# Altium schematic sheet Brelok(CR2430).SchDoc
size A4
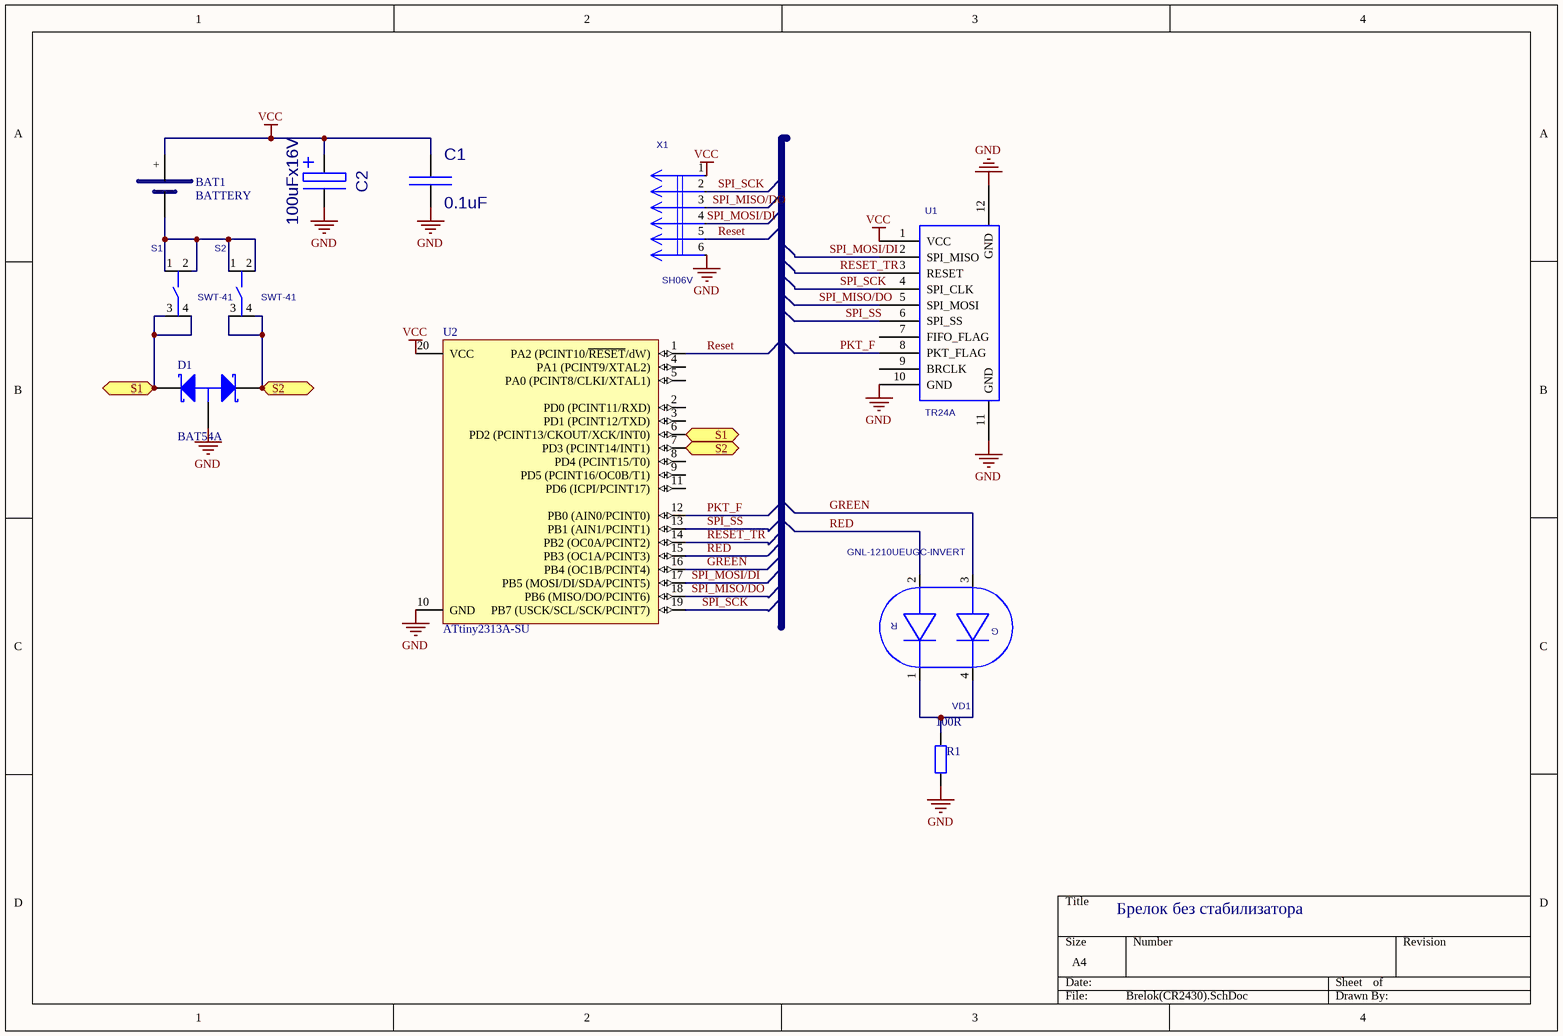
[diagram p0: Brelok(CR2430).SchDoc]

## Parts
BAT1  BATTERY  [HU2430]
C1  value 0.1uF  [C0805]  (hidden comment: KONDENS_SMD)
C2  100uFx16V  [CAP 5mm Horizontal]
D1  BAT54A  [SOT23_M]
R1  value 100R  [C0805]  (hidden comment: RES)
S1  SWT-41  [SWT-41]
S2  SWT-41  [SWT-41]
U1  TR24A  [TR24A]
U2  ATtiny2313A-SU  [20S_M]
VD1  GNL-1210UEUGC-INVERT  [GNL-1210UEUGC-INVERT]
X1  SH06V  [SH06V]

## Ports
S1, S2

## Nets
GND: C1.2(B) C2.2(MINUS) D1.3(A) R1.1 U1.10(GND) U1.11(GND) U1.12(GND) U2.10(GND) X1.6
VCC: BAT1.+ C1.1(A) C2.1(PLUS) U1.1(VCC) U2.20(VCC) X1.1
GREEN: U2.16(PB4_(OC1B/PCINT4)) VD1.3
PKT_F: U1.8(PKT_FLAG) U2.12(PB0_(AIN0/PCINT0))
RED: U2.15(PB3_(OC1A/PCINT3)) VD1.2
Reset: U2.1(PA2_(PCINT10/~{RESET}/dW)) X1.5
RESET_TR: U1.3(RESET) U2.14(PB2_(OC0A/PCINT2))
S1: D1.2(K2) S1.3 S1.4 U2.6(PD2_(PCINT13/CKOUT/XCK/INT0)) ; port S1
S2: D1.1(K1) S2.3 S2.4 U2.7(PD3_(PCINT14/INT1)) ; port S2
SPI_MISO/DO: U1.5(SPI_MOSI) U2.18(PB6_(MISO/DO/PCINT6)) X1.3
SPI_MOSI/DI: U1.2(SPI_MISO) U2.17(PB5_(MOSI/DI/SDA/PCINT5)) X1.4
SPI_SCK: U1.4(SPI_CLK) U2.19(PB7_(USCK/SCL/SCK/PCINT7)) X1.2
SPI_SS: U1.6(SPI_SS) U2.13(PB1_(AIN1/PCINT1))
NetBAT1_-: BAT1.- S1.1 S1.2 S2.1 S2.2
NetR1_2: R1.2 VD1.1 VD1.4

Not connected (* = marked no-connect by the designer): U1 7(FIFO_FLAG) 9(BRCLK); U2 2(PD0_(PCINT11/RXD)) 3(PD1_(PCINT12/TXD)) 4(PA1_(PCINT9/XTAL2)) 5(PA0_(PCINT8/CLKI/XTAL1)) 8(PD4_(PCINT15/T0)) 9(PD5_(PCINT16/OC0B/T1)) 11(PD6_(ICPI/PCINT17)); X1 7(GND) 8(GND)

## Notes on the sheet
- Брелок без стабилизатора
- (in symbol GNL-1210UEUGC-INVERT) R; G

## Library data of the parts
C2 = KONDENS-E6.5MM: Value: 100uFx16V
D1 = BAT54A: Schottky Barrier Double Diode; Published: 17-Sep-2003; LatestRevisionDate: 12-Dec-2006; LatestRevisionNote: IPC-7351 Footprint Added.; DatasheetVersion: 4-Mar-2002; PackageVersion: May-1999; PackageReference: SOT23; Publisher: Altium Limited; PackageDescription: 3-Pin SOT-23 Package 0.95 mm Pitch, 2.3 mm Lead Span; ComponentLink1Description: Manufacturer Link; ComponentLink1URL: http://www.semiconductors.philips.com/; ComponentLink2Description: Datasheet; ComponentLink2URL: http://www.semiconductors.philips.com/acrobat/datasheets/BAT54_SERIES_4.pdf
R1 = RES: Resistor
U2 = ATtiny2313A-SU: 8-bit AVR Microcontroller, 1.8-5.5V, 2KB Flash, 128 Bytes EEPROM, 128 Bytes SRAM, 20-pin SOIC, Industrial Grade (-40°C to 85°C), Pb-Free; Published: 1-Apr-2010; DatasheetVersion: revA, Dec-2009; PackageVersion: revA, Jan-2002; PackageReference: 20S; Publisher: Altium Limited; PackageDescription: 20-lead, 0.300" Wide Body, Plastic Gull Wing Small Outline Package (SOIC); Supplier 1: Digi-Key; Supplier Part Number 1: ATTINY2313A-SU-ND; Supplier 2: Mouser; Supplier Part Number 2: 556-ATTINY2313A-SU; Code_JEDEC: MS-013-AC; Code_IPC: SOIC127P1030-20; ComponentLink1Description: Manufacturer Link; ComponentLink1URL: http://www.atmel.com/products/avr/default.asp?; ComponentLink2Description: ATtiny2313A/4313 Datasheet; ComponentLink2URL: http://www.atmel.com/dyn/resources/prod_documents/doc8246.pdf; ComponentLink3Description: ATtiny2313A/4313 Summary; ComponentLink3URL: http://www.atmel.com/dyn/resources/prod_documents/8246S.pdf; ComponentLink4Description: Atmel.com Home; ComponentLink4URL: http://www.atmel.com
S1 S2 = SWT-41: Value: *
U1 = TR24A: Value: *
VD1 = GNL-1210UEUGC-INVERT: Value: *
X1 = SH06V: Value: *